# EasyEDA Pro project ConeZ-v0_1.eprj, board PCB1
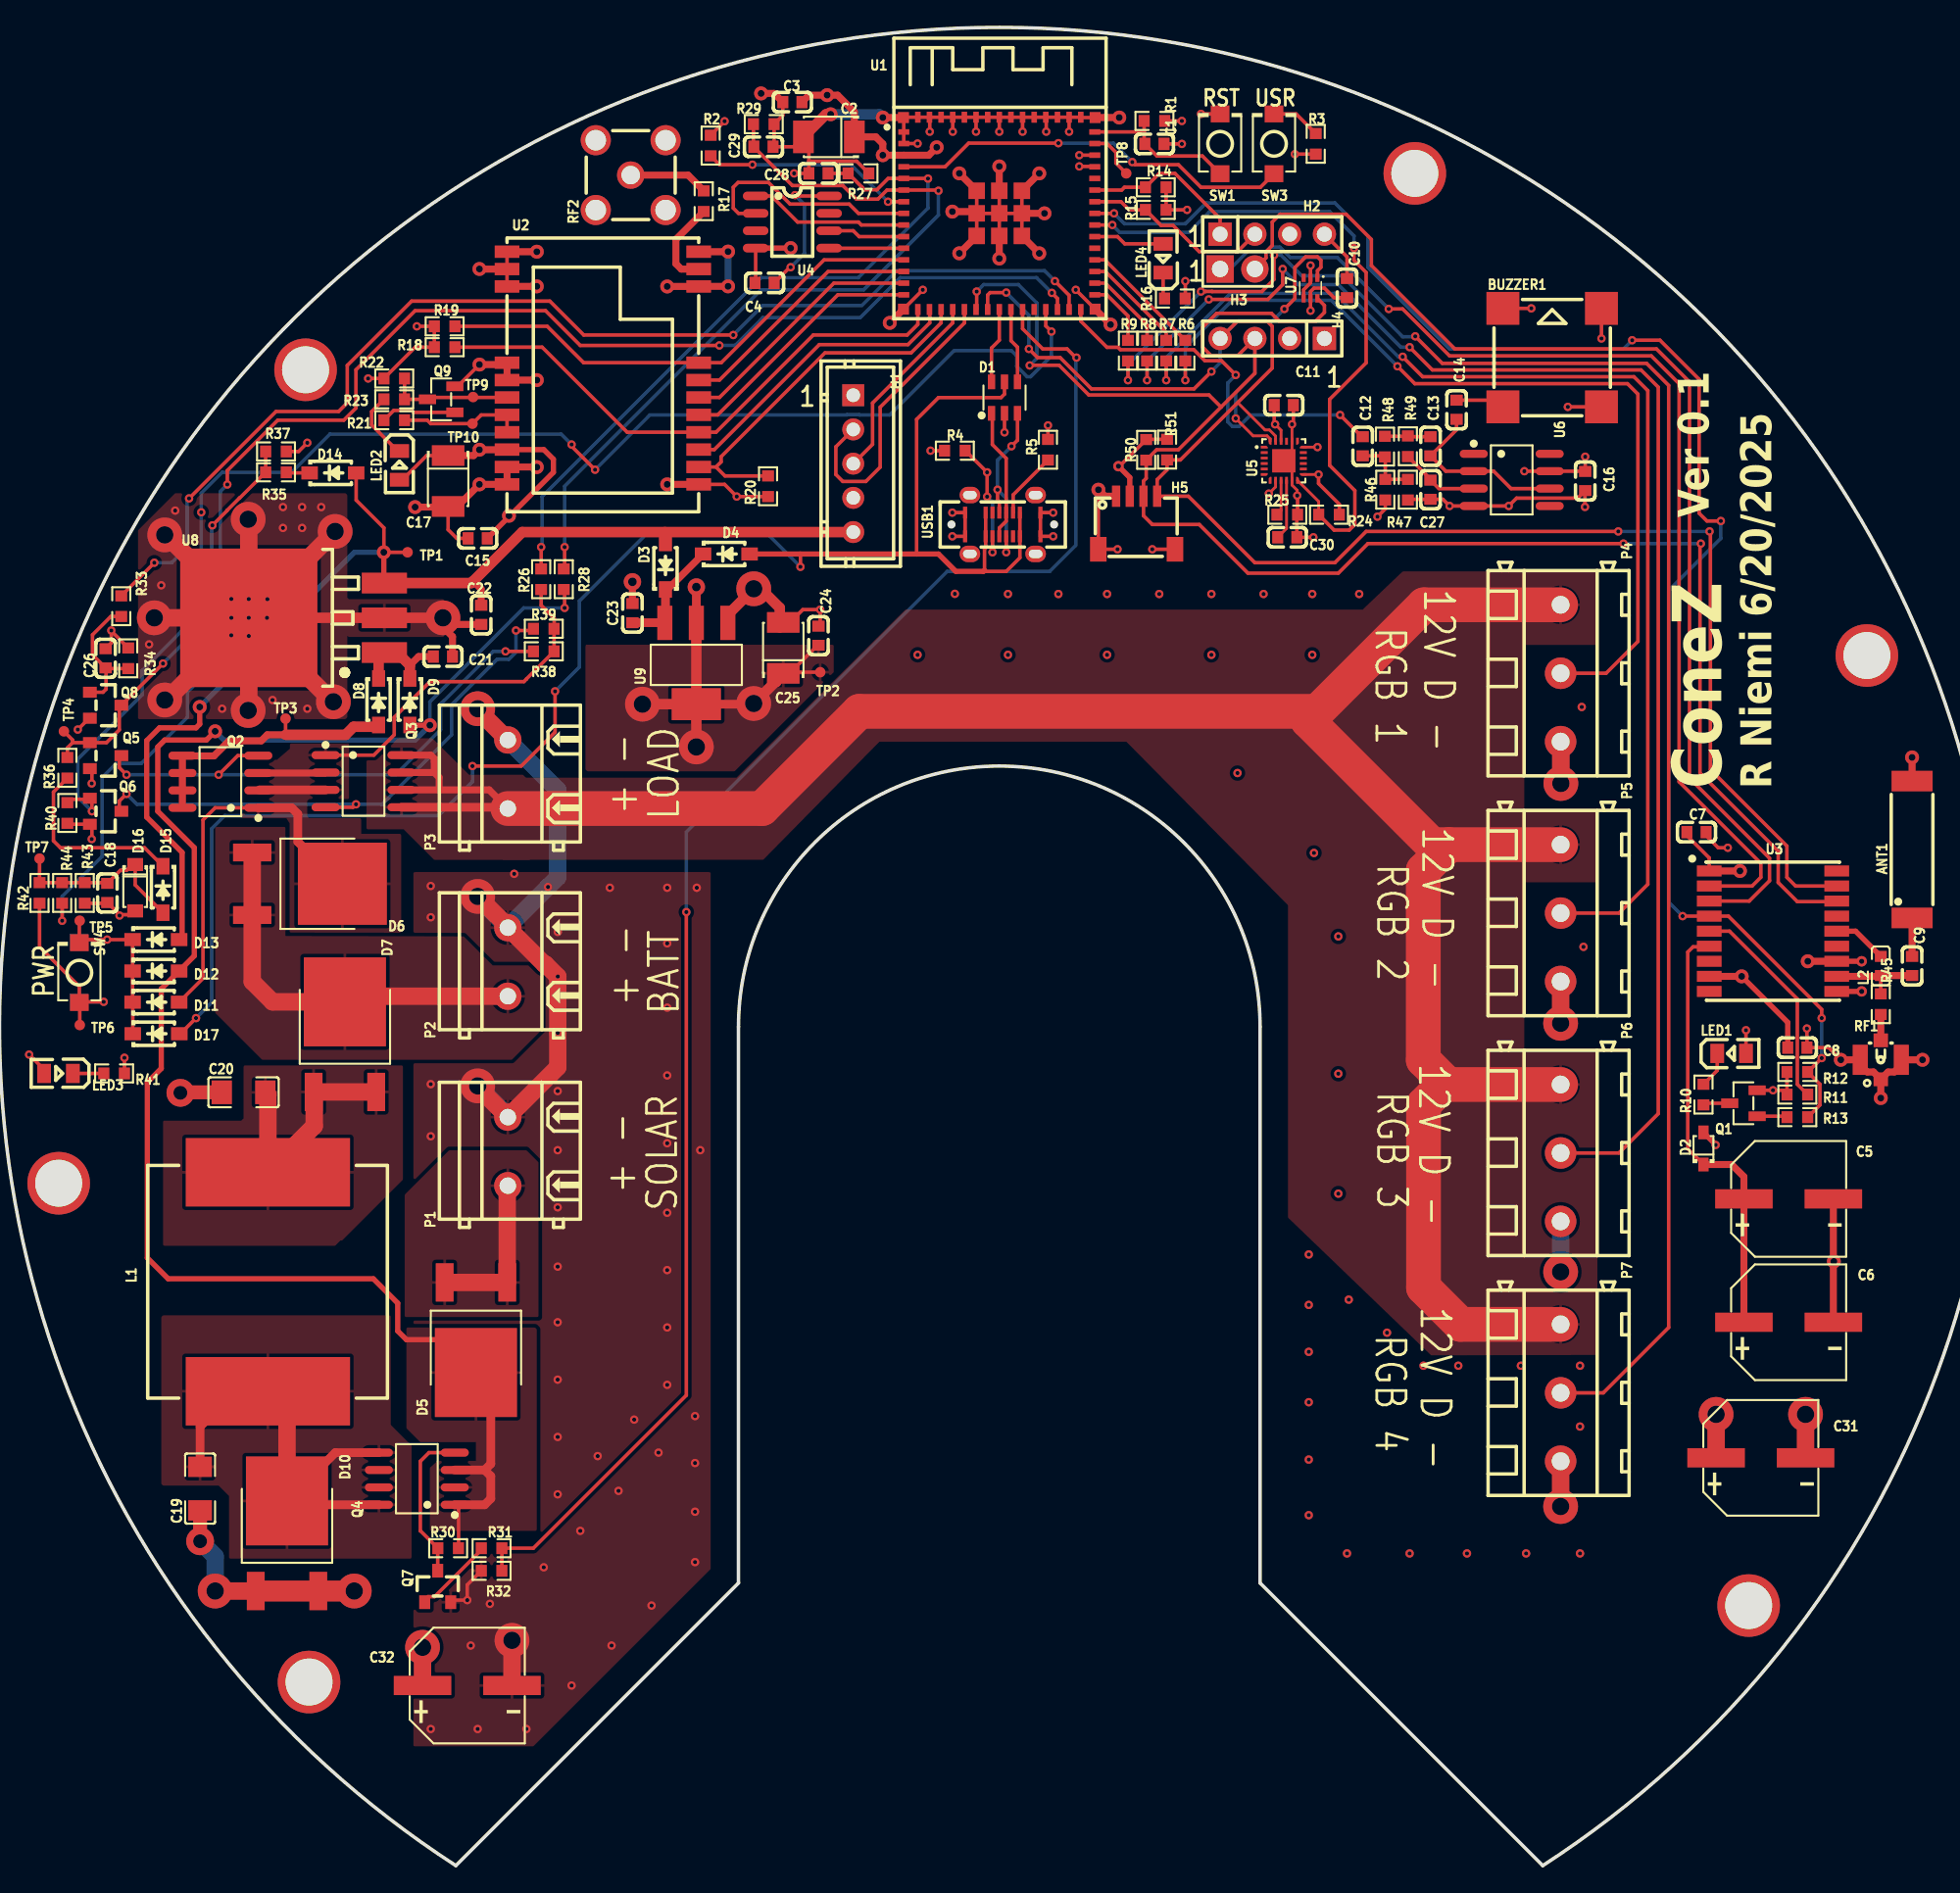
[diagram p1: board, top side]
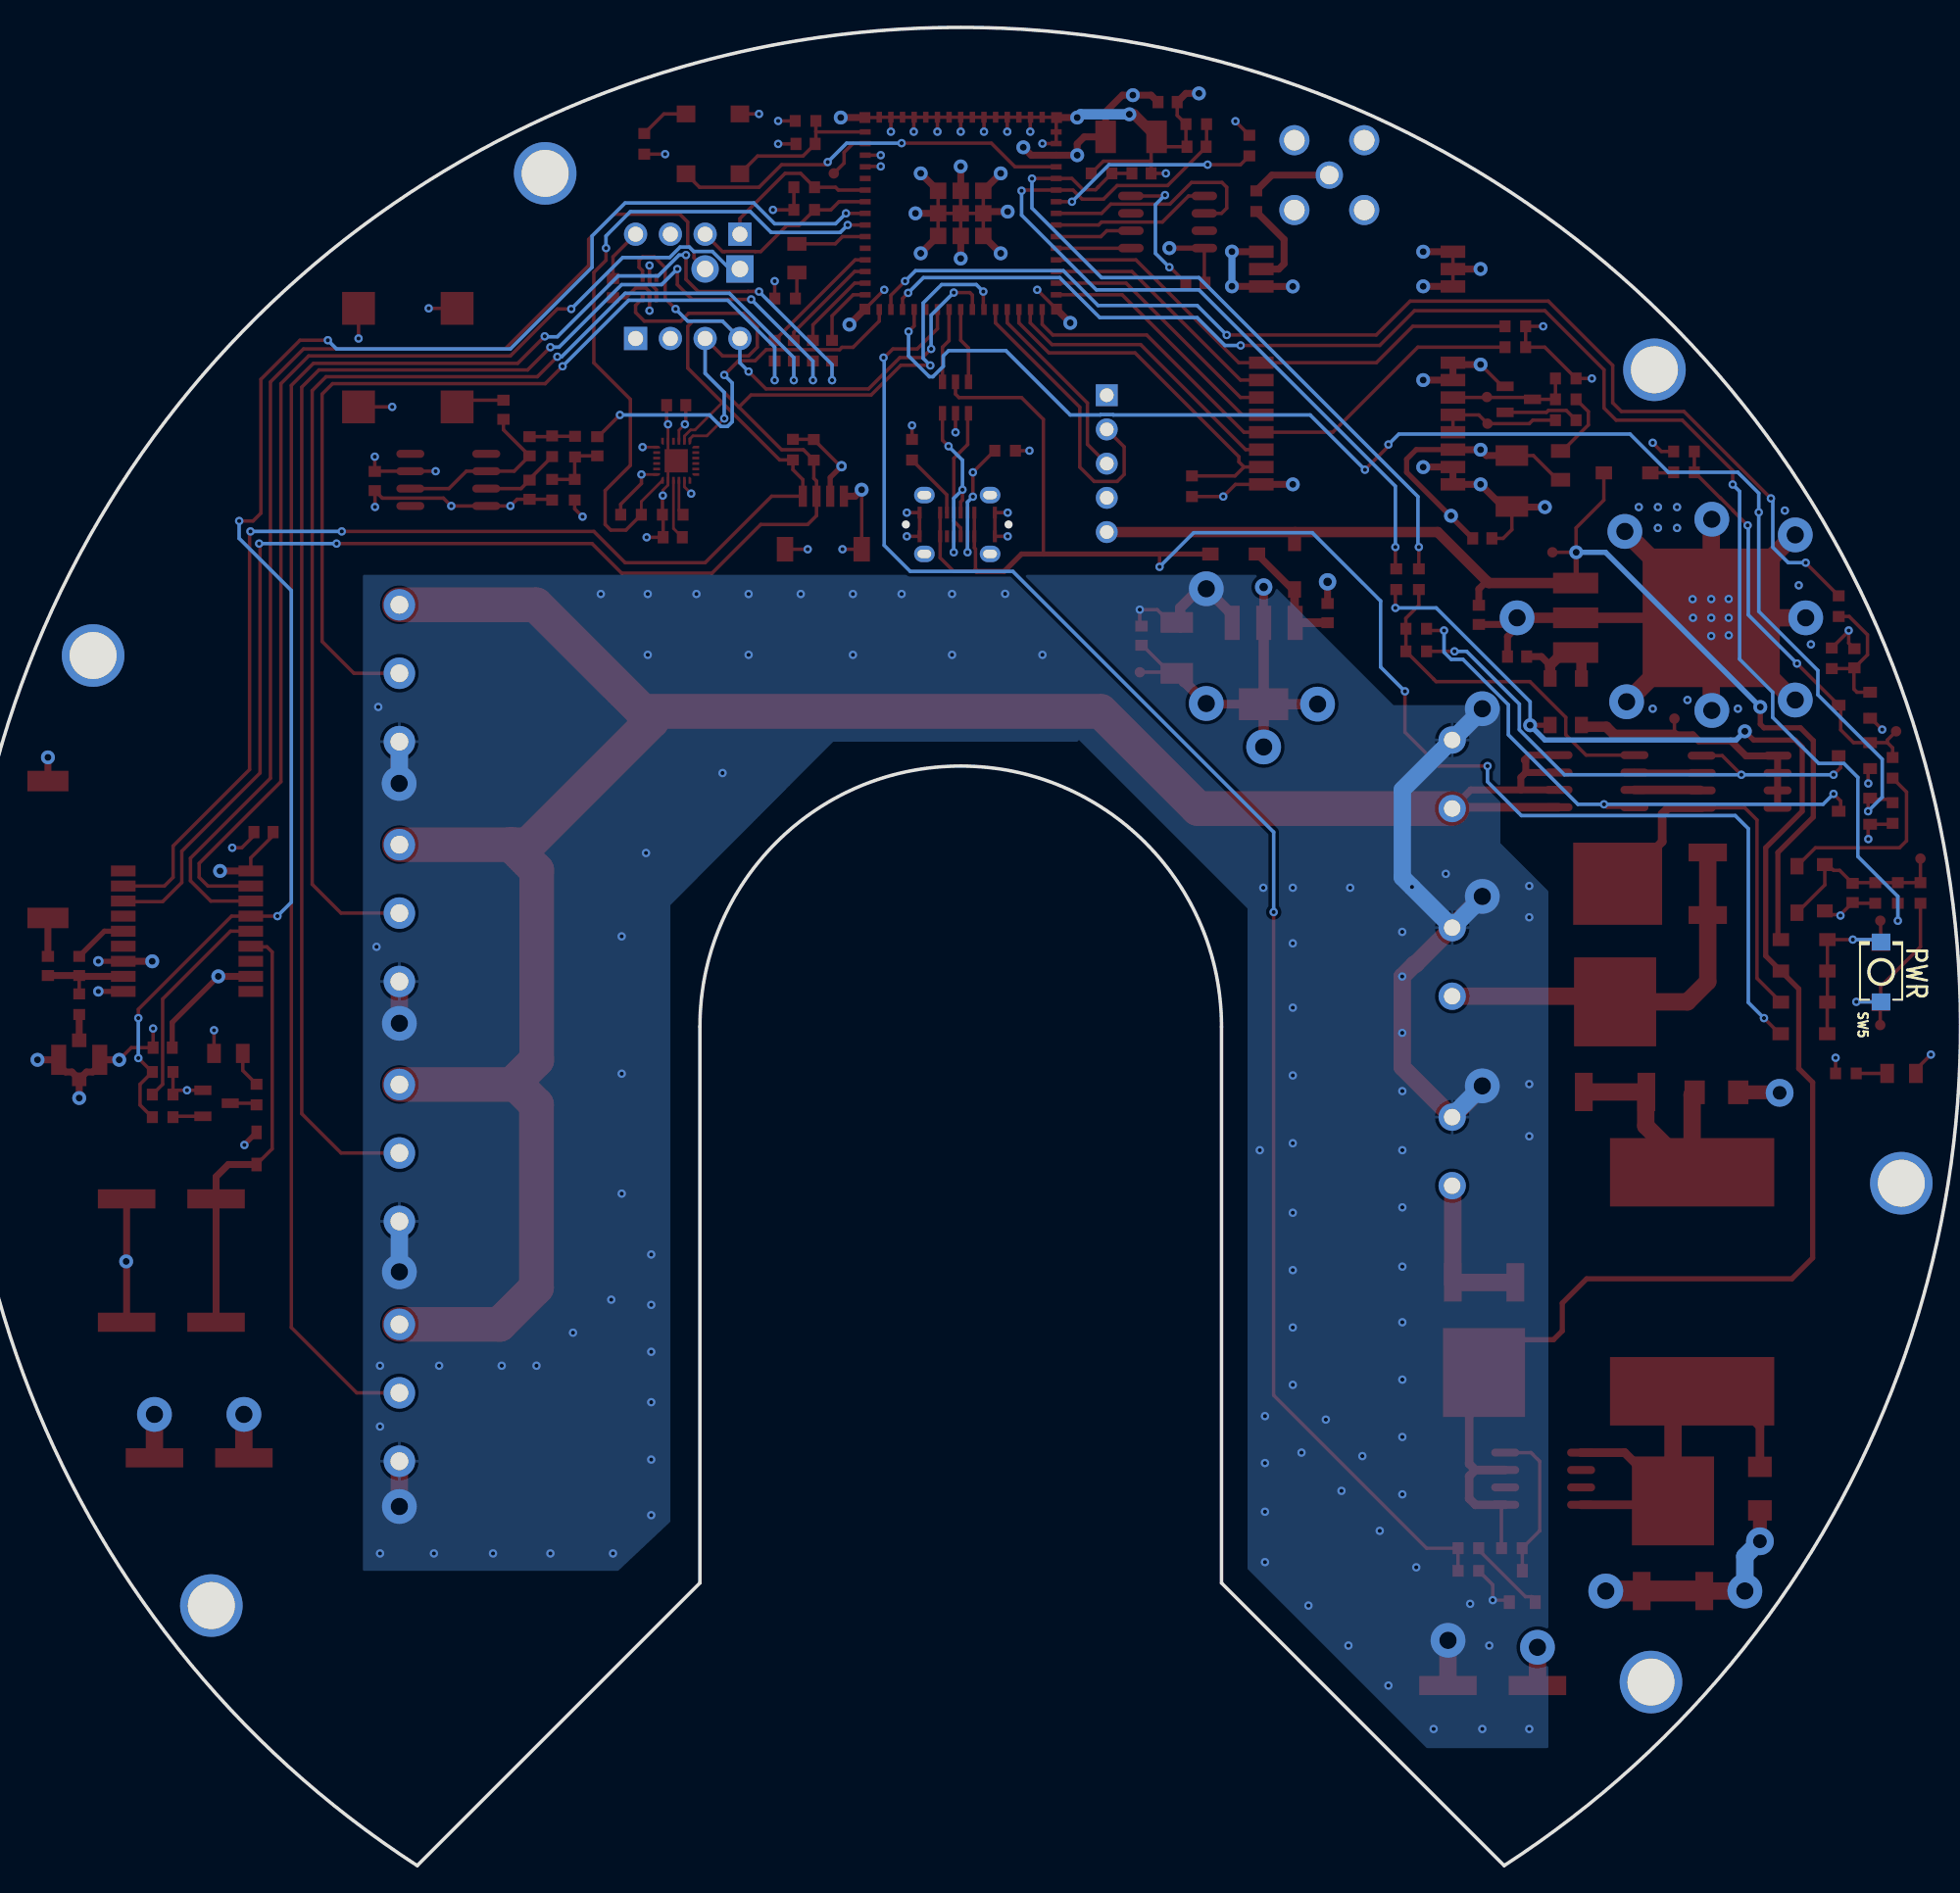
[diagram p2: board, bottom side, seen from below]

Outline 146.05 x 134.32 mm; copper layers: Top Layer, Inner1, Inner2, Bottom Layer. Coordinates in mm from the lower left corner of the outline.
Outline path: 33.33,0 arc(73.03,134.32) 112.72,0 92.08,20.65 92.08,61.29 arc(73.03,80.34) 53.98,61.29 53.98,20.65 33.33,0
Stack: Top Layer 0.035mm Outer layer thickness 1oz / Dielectric1 0.2104mm 7628 RC49% 8.6mil / Inner1 0.0152mm Inner layer thickness / Dielectric2 1.065mm 1.1mm H/HOZ Copper / Inner2 0.0152mm Inner layer thickness / Dielectric3 0.2104mm 7628 RC49% 8.6mil / Bottom Layer 0.035mm Outer layer thickness 1oz

## Design rules (mm)
template: JLCPCB Capability(Multiple Layers Board)
spacing copperThickness1oz (default): track to track 0.102, other pairs 0.152 to 0.3
spacing copperThickness2oz: track to track 0.203, other pairs 0.152 to 0.3
spacing copperThicknessInner0.5oz: track to track 0.089, other pairs 0.152 to 0.3
track width copperThickness1oz (default): min 0.102, default 0.254, max 2.54
track width copperThickness2oz: min 0.203, default 0.254, max 2.54
track width copperThickness0.5oz: min 0.089, default 0.254, max 2.54
differential pair differentialPair (default): width min 0.127, default 0.254, max 2.54; gap min 0.152, default 0.152
via viaSize (default): diameter min 0.3, default 0.61, max 10; hole min 0.2, default 0.305, max 6.3

## Placement (name value [footprint] x y rotation side)
ANT1  GPS1003  [ANT-SMD_L10.0-W3.0]  139.7 74.25 90 top
BUZZER1  2.7kHz  [BUZ-SMD_4P-L8.5-W8.5-P8.50-BR]  113.41 110.19 0 top
C1  1uF  [C0603]  84.36 125.8 180 top
C2  100uF  [CASE-B_3528]  60.58 126.32 180 top
C3  100nF  [C0603]  57.91 128.86 0 top
C4  100nF  [C0603]  55.88 115.65 0 top
C5  1000uF  [CAP-SMD_BD8.0-L8.3-W8.3-FD]  130.69 48.72 0 top
C6  1000uF  [CAP-SMD_BD8.0-L8.3-W8.3-FD]  130.69 39.7 0 top
C7  100nF  [C0603]  123.95 75.52 0 top
C8  10uF  [C0603]  131.32 59.77 180 top
C9  47pF  [C0603]  139.7 65.74 270 top
C10  100nF  [C0603]  98.43 115.27 270 top
C11  100nF  [C0603]  93.81 106.71 180 top
C12  1uF  [C0603]  99.57 103.71 270 top
C13  2.2nF  [C0603]  104.52 103.71 270 top
C14  1uF  [C0603]  106.43 106.38 90 top
C15  100nF  [C0603]  34.93 96.98 0 top
C16  10uF  [C0603]  115.83 101.17 90 top
C17  100uF  [CASE-B_3528]  32.77 101.17 270 top
C18  1uF  [C0603]  7.88 71.07 90 top
C19  22uF  [C1206]  14.65 27.55 90 top
C20  22uF  [C1206]  17.82 56.5 0 top
C21  10uF  [C0603]  32.39 88.34 180 top
C22  10uF  [C0603]  35.18 91.39 90 top
C23  10uF  [C0603]  46.23 91.52 270 top
C24  10uF  [C0603]  59.82 89.87 270 top
C25  100uF  [CASE-B_3528]  57.25 88.98 90 top
C26  1uF  [C0603]  7.75 88.22 270 top
C27  1nF  [C0603]  104.52 100.54 90 top
C28  100nF  [C0603]  59.82 123.65 0 top
C29  100nF  [C0603]  55.8 125.6 180 top
C30  100nF  [C0603]  94.06 97.06 180 top
C31  1000uF  [CAP-SMD_BD8.0-L8.3-W8.3-FD]  128.65 29.8 0 top
C32  1000uF  [CAP-SMD_BD8.0-L8.3-W8.3-FD]  34.17 13.16 0 top
D1  USBLC6-2SC6  [SOT-23-6_L2.9-W1.6-P0.95-LS2.8-BL]  73.41 107.27 0 top
D2  1N5819WS  [SOD-323_L1.8-W1.3-LS2.5-RD]  124.46 52.4 90 top
D3  B5819W SL  [SOD-123_L2.7-W1.6-LS3.7-RD-1]  48.64 94.95 90 top
D4  B5819W SL  [SOD-123_L2.7-W1.6-LS3.7-RD-1]  53.09 95.84 0 top
D5  MOT2045D  [TO-252-2_L6.6-W6.1-P4.57-LS10.0-BR-CW]  34.8 39.32 90 top
D6  MOT2045D  [TO-252-2_L6.6-W6.1-P4.57-LS10.0-BR-CW]  21.75 71.74 180 top
D7  MOT2045D  [TO-252-2_L6.6-W6.1-P4.57-LS10.0-BR-CW]  25.23 59.82 270 top
D8  B5819W SL  [SOD-123_L2.7-W1.6-LS3.7-RD-1]  27.69 85.04 270 top
D9  B5819W SL  [SOD-123_L2.7-W1.6-LS3.7-RD-1]  29.97 85.04 270 top
D10  MOT2045D  [TO-252-2_L6.6-W6.1-P4.57-LS10.0-BR-CW]  21 23.36 270 top
D11  B5819W SL  [SOD-123_L2.7-W1.6-LS3.7-RD-1]  11.42 63.09 0 top
D12  B5819W SL  [SOD-123_L2.7-W1.6-LS3.7-RD-1]  11.42 65.37 0 top
D13  B5819W SL  [SOD-123_L2.7-W1.6-LS3.7-RD-1]  11.42 67.66 0 top
D14  B5819W SL  [SOD-123_L2.7-W1.6-LS3.7-RD-1]  24.35 101.76 0 top
D15  B5819W SL  [SOD-123_L2.7-W1.6-LS3.7-RD-1]  11.94 71.33 270 top
D16  MMSZ5231B-7-F  [SOD-123_L2.8-W1.8-LS3.7-RD]  9.91 71.45 270 top
D17  B5819W SL  [SOD-123_L2.7-W1.6-LS3.7-RD-1]  11.43 60.78 0 top
H1  XH-5A  [CONN-TH_5P-P2.50_XH-5A_C2318]  62.36 102.44 270 top
H2  KH-2.54PH180-1X4P-L11.5  [HDR-TH_4P-P2.54-V-M]  92.97 119.2 0 top
H3  KH-2.54PH180-1X2P-L11.5  [HDR-TH_2P-P2.54-V-M]  90.43 116.66 0 top
H4  KH-2.54PH180-1X4P-L11.5  [HDR-TH_4P-P2.54-V-M]  92.97 111.58 180 top
H5  SM04B-SRSS-TB(LF)(SN)  [CONN-SMD_4P-P1.00_SM04B-SRSS-TB-LF-SN]  83.06 98.12 0 top
L1  22uH  [IND-SMD_L17.5-W17.0_YXMAC1770]  19.6 42.66 90 top
L2  47nH  [L0603]  137.42 65.74 90 top
LED1  KT-0805Y  [LED0805-R-RD]  126.52 59.35 0 top
LED2  KT-0805Y  [LED0805-R-RD]  29.21 102.31 270 top
LED3  KT-0805Y  [LED0805-R-RD]  4.31 57.88 180 top
LED4  KT-0805Y  [LED0805-R-RD]  84.99 117.45 90 top
NOREF  -  [Pad_e3832]  4.32 49.86 0 top
NOREF#2  -  [Pad_e3827]  22.35 109.3 0 top
NOREF#3  -  [Pad_e3830]  136.4 88.42 0 top
NOREF#4  -  [Pad_e3831]  127.76 19 0 top
NOREF#5  -  [Pad_e3829]  103.38 123.65 0 top
NOREF#6  -  [Pad_e3833]  22.61 13.41 0 top
P1  WJ128V-5.0-2P  [CONN-TH_2P-P5.00_WJ128V-5.0-2P]  37.13 52.19 90 top
P2  WJ128V-5.0-2P  [CONN-TH_2P-P5.00_WJ128V-5.0-2P]  37.13 66.03 90 top
P3  WJ128V-5.0-2P  [CONN-TH_2P-P5.00_WJ128V-5.0-2P]  37.13 79.75 90 top
P4  WJ128V-5.0-3P  [CONN-TH_3P-P5.00_WJ128V-5.0-3P]  114.03 87.13 270 top
P5  WJ128V-5.0-3P  [CONN-TH_3P-P5.00_WJ128V-5.0-3P]  114.03 69.6 270 top
P6  WJ128V-5.0-3P  [CONN-TH_3P-P5.00_WJ128V-5.0-3P]  114.03 52.07 270 top
P7  WJ128V-5.0-3P  [CONN-TH_3P-P5.00_WJ128V-5.0-3P]  114.03 34.55 270 top
Q1  MMBT2222A 1P  [SOT-23-3_L2.9-W1.3-P1.90-LS2.4-BR]  127.38 55.7 0 top
Q2  IRF9310TRPBF  [SOIC-8_L4.9-W3.9-P1.27-LS6.0-BL]  16.13 79.2 90 top
Q3  IRF9310TRPBF  [SOIC-8_L4.9-W3.9-P1.27-LS6.0-BL]  26.59 79.24 270 top
Q4  IRF9310TRPBF  [SOIC-8_L4.9-W3.9-P1.27-LS6.0-BL]  30.48 28.27 90 top
Q5  AO3400  [SOT-23_L2.9-W1.3-P1.90-LS2.4-BR]  7.75 81.1 180 top
Q6  AO3400  [SOT-23_L2.9-W1.3-P1.90-LS2.4-BR]  7.75 77.04 180 top
Q7  AO3400  [SOT-23_L2.9-W1.3-P1.90-LS2.4-BR]  32.01 20.4 270 top
Q8  AO3400  [SOT-23_L2.9-W1.3-P1.90-LS2.4-BR]  7.75 84.79 180 top
Q9  MMBT2222A 1P  [SOT-23-3_L2.9-W1.3-P1.90-LS2.4-BR]  32.26 107.14 0 top
R1  10kΩ  [R0603]  84.36 127.48 0 top
R2  10kΩ  [R0603]  51.95 125.68 90 top
R3  1kΩ  [R0603]  96.14 125.81 90 top
R4  5.1kΩ  [R0603]  69.78 103.39 0 top
R5  5.1kΩ  [R0603]  76.58 103.46 270 top
R6  0Ω  [R0603]  86.62 110.7 270 top
R7  0Ω  [R0603]  85.22 110.7 270 top
R8  0Ω  [R0603]  83.82 110.7 270 top
R9  0Ω  [R0603]  82.43 110.7 270 top
R10  200Ω  [R0603]  124.46 56.34 90 top
R11  10kΩ  [R0603]  131.32 56.34 0 top
R12  10kΩ  [R0603]  131.32 57.99 0 top
R13  1kΩ  [R0603]  131.32 54.69 180 top
R14  10kΩ  [R0603]  84.46 122.63 0 top
R15  10kΩ  [R0603]  84.46 120.98 0 top
R16  200Ω  [R0603]  85.85 114.51 180 top
R17  0Ω  [R0603]  51.44 121.62 270 top
R18  10kΩ  [R0603]  32.51 110.95 180 top
R19  10kΩ  [R0603]  32.51 112.47 180 top
R20  10kΩ  [R0603]  56.14 100.79 90 top
R21  1kΩ  [R0603]  28.83 105.62 0 top
R22  10kΩ  [R0603]  28.83 108.66 180 top
R23  200Ω  [R0603]  28.83 107.14 180 top
R24  10kΩ  [R0603]  97.11 98.71 0 top
R25  10kΩ  [R0603]  94.06 98.71 180 top
R26  220kΩ  [R0603]  39.56 94 270 top
R27  10kΩ  [R0603]  62.74 123.65 180 top
R28  220kΩ  [R0603]  41.21 94 270 top
R29  10kΩ  [R0603]  55.82 127.25 180 top
R30  1kΩ  [R0603]  32.77 23.19 0 top
R31  100Ω  [R0603]  35.94 23.19 180 top
R32  10kΩ  [R0603]  35.94 21.54 0 top
R33  1kΩ  [R0603]  8.89 92.03 90 top
R34  10kΩ  [R0603]  9.4 88.22 270 top
R35  1kΩ  [R0603]  20.2 101.81 0 top
R36  1kΩ  [R0603]  4.96 80.22 270 top
R37  10kΩ  [R0603]  20.2 103.33 180 top
R38  10kΩ  [R0603]  39.75 88.72 0 top
R39  10kΩ  [R0603]  39.75 90.38 0 top
R40  10kΩ  [R0603]  4.96 76.91 90 top
R41  200Ω  [R0603]  8.37 57.88 180 top
R42  1kΩ  [R0603]  2.92 71.07 270 top
R43  100kΩ  [R0603]  6.23 71.07 90 top
R44  10kΩ  [R0603]  4.57 71.07 90 top
R45  0Ω  [R0603]  137.42 62.94 270 top
R46  100kΩ  [R0603]  101.22 100.54 270 top
R47  100kΩ  [R0603]  102.87 100.54 90 top
R48  10kΩ  [R0603]  101.2 103.69 90 top
R49  10kΩ  [R0603]  102.87 103.71 90 top
R50  4.7kΩ  [R0603]  83.76 103.45 270 top
R51  4.7kΩ  [R0603]  85.28 103.47 270 top
RF1  KH-IPEX-K501-29  [ANT-SMD_KH-IPEX-K501-29]  137.42 58.88 0 top
RF2  BWSMA-KE-Z001  [SMA-TH_BWSMA-KE-Z001]  46.1 123.52 90 top
SW1  TS-1088-AR02016  [SW-SMD_L3.9-W3.0-P4.45]  89.16 125.81 90 top
SW3  TS-1088-AR02016  [SW-SMD_L3.9-W3.0-P4.45]  93.09 125.81 90 top
SW4  TS-1088-AR02016  [SW-SMD_L3.9-W3.0-P4.45]  5.83 65.25 90 top
SW5  TS-1088-AR02016  [SW-SMD_L3.9-W3.0-P4.45]  5.8 65.3 90 bottom
TP1  -  [Test-Point-0.5mm]  29.8 95.96 0 top
TP2  -  [Test-Point-0.5mm]  59.95 87.2 0 top
TP3  -  [Test-Point-0.5mm]  20.89 83.81 0 top
TP4  -  [Test-Point-0.5mm]  4.7 82.88 0 top
TP5  -  [Test-Point-0.5mm]  5.86 69.04 180 top
TP6  -  [Test-Point-0.5mm]  5.86 61.42 180 top
TP7  -  [Test-Point-0.5mm]  2.92 73.58 0 top
TP8  -  [Test-Point-0.5mm]  82.3 123.65 0 top
TP9  -  [Test-Point-0.5mm]  34.59 107.31 0 top
TP10  -  [Test-Point-0.5mm]  34.55 105.36 0 top
U1  ESP32-S3-MINI  [BULETM-SMD_ESP32-S3-MINI-1-N8]  73.03 120.73 0 top
U2  E22-400M22S  [WIRELM-SMD_E22-400M22S]  44.07 109.43 180 top
U3  ATGM336H-5NR32  [GPS-SMD_18P-L10.1-W9.7-P1.10-TL]  129.54 68.28 0 top
U4  LY68L6400SLIT  [SOP-8_L4.9-W3.9-P1.27-LS6.0-BL]  57.91 120.09 270 top
U5  MPU-6500  [QFN-24_L3.0-W3.0-P0.40-BL-EP]  93.81 102.65 270 top
U6  TL071HIDR  [SOIC-8_L4.9-W3.9-P1.27-LS6.0-BL]  110.46 101.25 270 top
U7  TMP102AIDRLR  [SOT-563_L1.6-W1.2-P0.50-LS1.6-BR]  95.76 115.27 90 top
U8  LM7805S/TR  [TO-263-3_L8.6-W10.2-P2.54-LS14.4-BR]  23.16 91.18 0 top
U9  AMS1117-3.3  [SOT-223-3_L6.5-W3.4-P2.30-LS7.0-BR]  50.9 87.84 90 top
USB1  TYPEC-303-ACP16  [USB-C-SMD_TYPEC-303-ACP16]  73.28 98 0 top

## Footprints (pads in the part's own frame, mm; a bottom-side part is the same pattern mirrored in y, then rotated)
ANT-SMD_KH-IPEX-K501-29
  rect 1.05x1 smd: 1(0,-1.425) 4(0,1.425)
  rect 1.1x2.2 smd: 2(-1.5,0) 3(1.5,0)
ANT-SMD_L10.0-W3.0
  rect 1.5x3 smd: 1(-5,0) 2(5,0)
BULETM-SMD_ESP32-S3-MINI-1-N8
  rect 0.8x0.4 smd: 1(-6.975,5.95) 2(-6.975,5.1) 3(-6.975,4.25) 4(-6.975,3.4) 5(-6.975,2.55) 6(-6.975,1.7) 7(-6.975,0.85) 8(-6.975,0) 9(-6.975,-0.85) 10(-6.975,-1.7) 11(-6.975,-2.55) 12(-6.975,-3.4) 13(-6.975,-4.25) 14(-6.975,-5.1) 15(-6.975,-5.95) 31(6.975,-5.95) 32(6.975,-5.1) 33(6.975,-4.25) 34(6.975,-3.4) 35(6.975,-2.55) 36(6.975,-1.7) 37(6.975,-0.85) 38(6.975,0) 39(6.975,0.85) 40(6.975,1.7) 41(6.975,2.55) 42(6.975,3.4) 43(6.975,4.25) 44(6.975,5.1) 45(6.975,5.95)
  rect 0.4x0.8 smd: 16(-5.95,-7.025) 17(-5.1,-7.025) 18(-4.25,-7.025) 19(-3.4,-7.025) 20(-2.55,-7.025) 21(-1.7,-7.025) 22(-0.85,-7.025) 23(0,-7.025) 24(0.85,-7.025) 25(1.7,-7.025) 26(2.55,-7.025) 27(3.4,-7.025) 28(4.25,-7.025) 29(5.1,-7.025) 30(5.95,-7.025) 46(5.95,7.025) 47(5.1,7.025) 48(4.25,7.025) 49(3.4,7.025) 50(2.55,7.025) 51(1.7,7.025) 52(0.85,7.025) 53(0,7.025) 54(-0.85,7.025) 55(-1.7,7.025) 56(-2.55,7.025) 57(-3.4,7.025) 58(-4.25,7.025) 59(-5.1,7.025) 60(-5.95,7.025)
  rect 0.8x0.8 smd: GND(-7,7) GND(-7,-7) GND(7,7) GND(7,-7)
  rect 1.2x1.2 smd: GND(-1.65,1.65) GND(-1.65,0) GND(-1.65,-1.65) GND(0,1.65) GND(0,0) GND(0,-1.65) GND(1.65,1.65) GND(1.65,0) GND(1.65,-1.65)
BUZ-SMD_4P-L8.5-W8.5-P8.50-BR
  rect 2.4x2.4 smd: 1(-3.6,-3.6) 2(3.6,-3.6) 3(3.599,3.599) 4(-3.6,3.6)
C0603
  rect 0.8x0.9 smd: 1(-0.7,0) 2(0.7,0)
C1206
  rect 1.485x1.728 smd: 1(-1.593,0) 2(1.593,0)
CAP-SMD_BD8.0-L8.3-W8.3-FD
  rect 4.2x1.4 smd: 1(-3.267,0) 2(3.267,0)
CASE-B_3528
  rect 1.506x2.376 smd: 1(-1.861,0) 2(1.861,0)
CONN-SMD_4P-P1.00_SM04B-SRSS-TB-LF-SN
  rect 0.6x1.55 smd: 1(-1.5,1.938) 2(-0.5,1.938) 3(0.5,1.938) 4(1.5,1.938)
  rect 1.2x1.8 smd: 5(2.8,-1.938) 6(-2.8,-1.938)
CONN-TH_2P-P5.00_WJ128V-5.0-2P
  round 2 hole 1.2: 1(-2.505,0) 2(2.505,0)
CONN-TH_3P-P5.00_WJ128V-5.0-3P
  round 2.3 hole 1.3: 1(-5,0) 2(0.003,0) 3(5,0)
CONN-TH_5P-P2.50_XH-5A_C2318
  rect 1.6x1.6 hole 1: 1(-5,0)
  round 1.6 hole 1: 2(-2.5,0) 3(0,0) 4(2.5,0) 5(5,0)
GPS-SMD_18P-L10.1-W9.7-P1.10-TL
  rect 1.8x0.8 smd: 1(-4.657,4.4) 2(-4.657,3.3) 3(-4.657,2.2) 4(-4.657,1.1) 5(-4.657,0) 6(-4.657,-1.1) 7(-4.657,-2.2) 8(-4.657,-3.3) 9(-4.657,-4.4) 10(4.657,-4.4) 11(4.657,-3.3) 12(4.657,-2.2) 13(4.657,-1.1) 14(4.657,0) 15(4.657,1.1) 16(4.657,2.2) 17(4.657,3.3) 18(4.657,4.4)
HDR-TH_2P-P2.54-V-M
  rect 2x2 hole 1.2: 1(-1.27,0)
  round 2 hole 1.2: 2(1.27,0)
HDR-TH_4P-P2.54-V-M
  rect 1.7x1.7 hole 1.1: 1(-3.81,0)
  round 1.7 hole 1.1: 2(-1.27,0) 3(1.27,0) 4(3.81,0)
IND-SMD_L17.5-W17.0_YXMAC1770
  rect 5x12 smd: 1(-8,0) 2(8,0)
L0603
  rect 0.8x0.864 smd: 1(-0.7,0) 2(0.7,0)
LED0805-R-RD
  rect 1x1.399 smd: 1(1.05,0) 2(-1.05,0)
Pad_e3827
  round 4.572 hole 3.429: 1(0,0)
Pad_e3829
  round 4.572 hole 3.429: 1(0,0)
Pad_e3830
  round 4.572 hole 3.429: 1(0,0)
Pad_e3831
  round 4.572 hole 3.429: 1(0,0)
Pad_e3832
  round 4.572 hole 3.429: 1(0,0)
Pad_e3833
  round 4.572 hole 3.429: 1(0,0)
QFN-24_L3.0-W3.0-P0.40-BL-EP
  custom 0.2x0.506 smd: 1(-1,-1.427) 6(1,-1.427) 13(1,1.427) 18(-1,1.427)
  rect 0.2x0.505 smd: 2(-0.6,-1.427) 3(-0.2,-1.427) 4(0.2,-1.427) 5(0.6,-1.427) 14(0.6,1.427) 15(0.2,1.427) 16(-0.2,1.427) 17(-0.6,1.427)
  custom 0.506x0.2 smd: 7(1.427,-1) 12(1.427,1) 19(-1.427,1) 24(-1.427,-1)
  rect 0.505x0.2 smd: 8(1.427,-0.6) 9(1.427,-0.2) 10(1.427,0.2) 11(1.427,0.6) 20(-1.427,0.6) 21(-1.427,0.2) 22(-1.427,-0.2) 23(-1.427,-0.6)
  rect 1.7x1.7 smd: 25(0,0)
R0603
  rect 0.806x0.864 smd: 1(-0.753,0) 2(0.753,0)
SMA-TH_BWSMA-KE-Z001
  round 2.2 hole 1.5: 1(-2.55,-2.55) 2(-2.55,2.55) 3(2.55,2.55) 4(2.55,-2.55)
  round 2 hole 1.35: 5(0,0)
SOD-123_L2.7-W1.6-LS3.7-RD-1
  rect 1.2x0.95 smd: 1(-1.7,0) 2(1.7,0)
SOD-123_L2.8-W1.8-LS3.7-RD
  rect 0.95x1.15 smd: 1(-1.692,0) 2(1.692,0)
SOD-323_L1.8-W1.3-LS2.5-RD
  rect 1x0.75 smd: 1(-1.173,0) 2(1.173,0)
SOIC-8_L4.9-W3.9-P1.27-LS6.0-BL
  oval 0.588x2.045 smd: 1(-1.905,-2.772) 2(-0.635,-2.772) 3(0.635,-2.772) 4(1.905,-2.772) 5(1.905,2.772) 6(0.635,2.772) 7(-0.635,2.772) 8(-1.905,2.772)
SOP-8_L4.9-W3.9-P1.27-LS6.0-BL
  oval 0.63x1.865 smd: 1(-1.905,-2.683) 2(-0.635,-2.683) 3(0.635,-2.683) 4(1.905,-2.683) 5(1.905,2.683) 6(0.635,2.683) 7(-0.635,2.683) 8(-1.905,2.683)
SOT-23-3_L2.9-W1.3-P1.90-LS2.4-BR
  rect 1.25x0.7 smd: 1(1,-0.95) 2(1,0.95) 3(-1,0)
SOT-23-6_L2.9-W1.6-P0.95-LS2.8-BL
  rect 0.532x1.072 smd: 1(-0.95,-1.149) 2(0,-1.149) 3(0.95,-1.149) 4(0.95,1.149) 5(0,1.149) 6(-0.95,1.149)
SOT-23_L2.9-W1.3-P1.90-LS2.4-BR
  rect 1x0.8 smd: 1(1.15,-0.95) 2(1.15,0.95) 3(-1.15,0)
SOT-223-3_L6.5-W3.4-P2.30-LS7.0-BR
  rect 2.5x1.1 smd: 1(2.97,-2.3) 2(2.97,0) 3(2.97,2.3)
  rect 2.34x3.6 smd: 4(-2.97,0)
SOT-563_L1.6-W1.2-P0.50-LS1.6-BR
  rect 0.6x0.3 smd: 1(0.75,-0.5) 2(0.75,0) 3(0.75,0.5) 4(-0.75,0.5) 5(-0.75,0) 6(-0.75,-0.5)
SW-SMD_L3.9-W3.0-P4.45
  rect 1.23x1.36 smd: 1(-2.185,0) 2(2.185,0)
Test-Point-0.5mm
  round 0.762 smd: 1(0,0)
TO-252-2_L6.6-W6.1-P4.57-LS10.0-BR-CW
  rect 2.8x1.3 smd: 1(3.292,-2.285) 3(3.292,2.285)
  rect 6.5x6 smd: 2(-3.292,0)
TO-263-3_L8.6-W10.2-P2.54-LS14.4-BR
  rect 3.3x1.511 smd: 1(4.952,-2.54) 2(4.952,0) 3(4.952,2.54)
  rect 10.02x10.122 smd: 4(-4.952,0)
USB-C-SMD_TYPEC-303-ACP16
  oval 1.5x1.2 hole 1x0.61: 1(-2.4,2.15) 2(-2.4,-2.15) 3(2.4,2.15) 4(2.4,-2.15)
  rect 0.3x0.87 smd: A1(-2.75,0.865) A4(-1.25,0.865) A5(-0.75,0.865) A6(-0.25,0.865) A7(0.25,0.865) A8(0.75,0.865) A9(1.25,0.865) A12(2.75,0.865) B1(2.75,-0.865) B4(1.25,-0.865) B5(0.75,-0.865) B6(0.25,-0.865) B7(-0.25,-0.865) B8(-0.75,-0.865) B9(-1.25,-0.865) B12(-2.75,-0.865)
WIRELM-SMD_E22-400M22S
  rect 1.8x0.9 smd: 1(7,-8.5) 2(7,-7.23) 3(7,-5.96) 4(7,-0.39) 5(7,0.88) 6(7,2.15) 7(7,3.42) 8(7,4.69) 9(7,5.96) 10(7,7.23) 11(7,8.5) 12(-7,8.5) 13(-7,7.23) 14(-7,5.96) 15(-7,4.69) 16(-7,3.42) 17(-7,2.15) 18(-7,0.88) 19(-7,-0.39) 20(-7,-5.96) 21(-7,-7.23) 22(-7,-8.5)

## Nets
As in the schematic, except:
GND: ANT1.2 BUZZER1.2 BUZZER1.3 BUZZER1.4 C1.1 C2.2 C3.1 C4.1 C5.2 C6.2 C7.1 C8.1 C10.1 C11.1 C15.1 C16.1 C17.2 C18.1 C19.1 C20.1 C21.1 C22.1 C23.1 C24.1 C25.2 C26.1 C27.1 C28.1 C29.1 C30.1 C31.2 C32.2 D1.2 D10.1 D10.3 D16.2 H1.1 H2.4 H4.1 H5.1 H5.5 H5.6 NOREF.1 NOREF#2.1 NOREF#3.1 NOREF#4.1 NOREF#5.1 NOREF#6.1 P1.2 P2.2 P3.2 P4.3 P5.3 P6.3 P7.3 Q1.2 Q5.2 Q6.2 Q7.2 Q8.2 Q9.2 R3.1 R4.1 R5.1 R11.1 R12.1 R16.1 R20.1 R25.1 R27.1 R29.1 R32.1 R34.1 R37.1 R40.1 R41.1 R43.1 R47.1 RF1.1 RF1.2 RF1.3 RF2.1 RF2.2 RF2.3 RF2.4 SW1.2 U1.1 U1.2 U1.42 U1.43 U1.46 U1.47 U1.48 U1.49 U1.50 U1.51 U1.52 U1.53 U1.54 U1.55 U1.56 U1.57 U1.58 U1.59 U1.60 U1.GND U2.1 U2.2 U2.3 U2.4 U2.5 U2.10 U2.11 U2.12 U2.20 U2.22 U3.1 U3.10 U3.12 U4.4 U5.11 U5.18 U5.20 U5.25 U6.4 U7.2 U7.4 U8.2 U8.4 U9.1 USB1.1 USB1.2 USB1.3 USB1.4 USB1.A1 USB1.A12 USB1.B1 USB1.B12

Pads without a net: U1 26 35 41; U3 7 9 13 15 18; U4 3 7; U5 1 2 3 4 5 6 7 14 15 16 17 19 21; U6 1 5 8; U7 3; USB1 A5 B5

## Via types
v1: diameter 0.61, hole 0.305, Top Layer to Bottom Layer, 250 vias
v2: diameter 2.54, hole 1.27, Top Layer to Bottom Layer, 25 vias
v3: diameter 1.016, hole 0.508, Top Layer to Bottom Layer, 45 vias
v4: diameter 1.27, hole 0.635, Top Layer to Bottom Layer, 2 vias
v5: diameter 2.032, hole 1.016, Top Layer to Bottom Layer, 2 vias
v6: diameter 0.762, hole 0.381, Top Layer to Bottom Layer, 3 vias

## Routing (per net, layer and track width the routed paths; a pad name or vN(x,y) marks a point on that pad's centre or on a via; arc(x,y) is an arc through that point)
3V3: length 134.7
  Top Layer w0.203: U5.8 93.21,100.74 v1(92.72,100.25) ; U5.13 v1(96.35,101.65) ; U5.22 93.61,104.88 v1(93.17,105.32)
  Top Layer w0.254: C17.1 31.2,103.03 29.56,101.39 28.96,101.39 ; v1(115.83,102.95) C16.2 115.81,101.89 U6.7 v1(111.38,101.89) ; v1(126.24,74.37) 125.54,74.37 124.65,75.26 ; v1(58.1,122.06) 58.17,122 U4.8 ; v1(52.96,127.46) 52.96,127.45 R2.2 ; 58.11,87.2 58.11,87.52 59.63,89.04 59.95,89.04 ; 58.11,87.2 TP2.1 ; 58.11,87.2 58.02,87.12 C25.1 ; v1(57.79,116.79) 57.73,116.79 56.58,115.65 ; C10.2 97.48,114.57 96.78,115.27 96.01,115.27 95.76,115.01 U7.5 v1(95.76,113.62) ; v1(100.65,98.57) 101.22,99.14 R46.2 ; v1(86.74,120.98) R15.2 R14.2 ; R51.1 83.78,104.22 R50.1 81.81,102.25 v6(81.73,102.25) ; v1(96.35,101.65) 96.35,100.99 97.86,99.47 R24.2 ; v1(30.48,112.47) R19.2 R18.2 30.36,110.95 R22.2 v1(26.93,108.66) ; v1(93.17,105.32) 93.11,105.38 93.11,106.59 ; v1(2.16,59.26) 3.26,58.17 LED3.1 ; R1.2 v1(86.36,127.48) ; LED1.1 v1(127.57,61.04)
  Top Layer w0.381: 130.62,59.77 130.62,61.61 v3(127.26,64.98) ; D2.2 125.35,52.69 v1(125.35,52.66) ; H5.2 82.56,101.42 v6(81.73,102.25) ; C15.2 37.21,98.57 v3(37.21,98.63) 37.28,98.63 40.46,101.81 40.46,102.76 39.75,103.47 37.07,103.47
  Top Layer w0.508: 37.07,103.47 37.06,103.46 v3(35.05,103.46) 34.63,103.03 C17.1 ; C3.2 59.12,129.36 v3(60.45,129.36) 61.22,129.36 62.44,128.14 C2.1 64.01,126.32 64.52,125.81 v3(64.52,124.98) U1.3 67.88,124.98 v3(68.46,125.55) ; 124.88,64.98 v3(127.26,64.98)
  Top Layer w0.635: U9.4 55.04,84.87 v2(55.09,84.91) ; U9.2 v4(50.9,93.42)
  Top Layer w0.762: v2(46.96,84.87) U9.4 v2(50.9,81.74) ; v2(55.09,84.91) 56.66,86.48 56.74,86.48 ; U9.2 50.9,85.17
  Top Layer w1.27: C31.1 v2(125.39,32.97) ; C32.1 v2(30.9,15.95)
  Bottom Layer w0.254: v1(57.79,116.79) 58.8,117.81 58.8,121.36 v1(58.1,122.06)
5V: length 88.3
  Top Layer w0.254: D3.2 48.64,97.4 48.6,97.44 ; v3(28.07,95.96) 28.08,95.97 28.08,97.75 26.05,99.77 D14.2 ; 29.42,95.96 28.07,95.96
  Top Layer w0.381: v3(28.07,95.96) 28.07,93.76 U8.3 ; D13.2 13.34,67.88 13.34,74.03 10.75,76.61 10.75,82.2 11.69,83.14 14.35,83.14 14.62,83.41 v3(14.62,84.66)
  Top Layer w0.508: 34.6,93.86 35.18,93.28 C22.2
  Top Layer w0.762: U8.3 34.46,93.72 38.18,97.44 H1.5
  Bottom Layer w0.381: v3(14.62,84.66) 25.93,95.96 v3(28.07,95.96)
12V_BLAH: length 63.3
  Top Layer w0.254: Q2.1 15.75,77.29 14.86,76.41 14.86,64.83 D11.2 ; R26.2 39.56,92.09 40.52,91.14 40.52,90.38 R39.2 R38.2 38.48,86.7 38.48,86.69 38.3,86.51 31.45,86.51 28.83,83.9 28.83,82.63 27.35,81.14 Q3.1
  Top Layer w0.508: Q2.3 23.78,79.83 Q3.2
  Top Layer w0.635: Q2.1 21.34,77.29 21.79,76.85 21.79,74.81 24.86,71.74 D6.2 ; 18.99,78.6 Q3.3
12V_IN: length 28.9
  Top Layer w1.27: P2.1 25.64,63.52 D7.2 19.94,63.11 18.46,64.59 D6.3 D6.1
12V_LOAD: length 183.8
  Top Layer w0.508: 32.09,78.6 35.77,78.6 37.04,77.33 ; 32.09,78.6 32.11,78.62 32.11,79.51 31.75,79.87 ; 32.09,78.6 Q3.6 ; 31.75,79.87 Q3.7 ; 31.75,79.87 31.75,80.68 31.86,80.78 31.5,81.14 Q3.8
  Top Layer w0.635: P3.1 37.04,77.33 Q3.5
  Top Layer w2.54: 96.27,84.34 104.05,92.13 P4.1 ; 96.27,84.34 62.8,84.34 55.7,77.24 P3.1 ; 96.27,84.34 95.57,83.65 104.62,74.6 105.88,74.6 ; 105.88,74.6 104,72.72 104,58.87 105.64,57.23 ; 105.88,74.6 P5.1 ; P6.1 105.79,57.07 105.64,57.23 ; 105.64,57.23 104.02,55.6 104.02,42.24 106.71,39.55 P7.1
12V_SW: length 20.1
  Top Layer w0.254: 20.91,82.63 20.89,82.64 TP3.1
  Top Layer w0.508: 20.91,82.63 19.56,82.63 19.12,82.18 16.77,82.18 15.67,81.08 13.36,81.08 Q2.6 Q2.7 13.36,77.42
  Top Layer w0.762: 20.91,82.63 25.28,82.63 25.86,83.21 27.56,83.21 D8.2
GND: length 449.5
  Top Layer w0.203: v1(94.79,100.11) 94.79,100.49 94.41,100.87 94.41,102.05 U5.25 94.41,103.25 v1(94.41,105.32) ; U5.18 v1(96.27,103.65)
  Top Layer w0.254: U1.49 U1.48 U1.47 ; U1.49 76.46,127.72 v1(76.46,126.7) ; U1.49 U1.50 U1.51 ; U1.53 v1(73.03,126.7) ; U1.53 U1.52 U1.51 ; U1.53 U1.54 U1.55 ; R32.1 34.17,20.52 v1(34.17,19.4) 32.96,19.4 ; U1.57 U1.58 U1.59 ; U1.57 U1.56 U1.55 ; U1.57 v1(69.63,126.7) ; U1.47 U1.46 79,127.73 U1.GND ; U1.47 v1(78.13,126.7) ; v1(94.79,100.11) 94.82,100.08 R25.1 94.76,98.66 C30.1 v1(95.97,97.06) ; v1(58.04,123.65) C28.1 59.12,124.57 ; R20.1 v1(53.85,100.04) 52.96,100.93 U2.12 ; v1(94.41,105.32) 94.51,105.42 94.51,106.59 ; 123.25,75.26 124.88,73.63 124.88,72.68 ; v1(76.96,97.13) USB1.B1 USB1.A12 v1(76.96,98.86) ; v1(67.06,125.83) U1.2 U1.1 66.05,127.7 U1.GND 66.05,127.75 U1.60 U1.59 ; Q9.2 33.46,108.09 v3(35.05,109.68) ; 8.77,69.48 9.76,69.48 10.04,69.76 ; 8.77,69.48 v1(8.77,69.42) ; 8.77,69.48 C18.1 7.82,70.32 R43.1 ; 59.12,124.57 59.15,124.54 62.6,124.54 R27.1 ; 59.12,124.57 59.12,125.92 C2.2 58,125.6 C29.1 56.58,125.67 R29.1 57.21,127.89 C3.1 ; C10.1 98.43,117.55 H2.4 ; 6.75,80.15 6.75,79.09 v1(6.73,79.07) ; D1.2 v1(73.41,104.73) ; U1.GND v1(78.62,115.14) ; 115.81,100.45 v1(115.81,99.28) ; 115.81,100.45 C16.1 ; 115.81,100.45 115.28,99.92 110.81,99.92 v1(110.24,99.35) U6.4 v1(105.92,99.35) 105.43,99.84 C27.1 102.93,99.84 R47.1 ; v1(6.73,75.01) 6.75,75.02 6.75,76.09 5.02,76.09 R40.1 ; U2.1 U2.2 U2.3 ; U1.55 v1(71.33,126.7) ; v1(78.87,124.16) 79.97,124.16 U1.42 ; U1.59 67.95,127.73 v1(67.95,126.7) ; v1(69.6,98.86) USB1.A1 USB1.B12 v1(69.6,97.13) ; R41.1 v1(9.12,59.03) ; U1.GND U1.GND ; U1.GND U1.GND ; U1.GND U1.GND ; U1.GND U1.GND ; U1.GND U1.GND ; U1.GND U1.GND ; v1(5.72,83.01) 6.75,84.04 6.75,84.09 ; 8.16,90.21 8.16,89.33 C26.1 ; 8.16,90.21 R34.1 ; 8.16,90.21 v1(8.16,90.25) ; U1.51 v1(74.73,126.7) ; R3.1 v1(94.62,125.06) ; BUZZER1.3 v1(117.01,111.58) ; C25.2 57.74,90.84 58.68,91.77 v1(59.95,91.77) 59.95,90.44 ; U1.GND U1.GND ; U1.GND U1.GND ; v3(80.27,100.54) 80.26,100.53 H5.6 v1(81.66,96.19) ; v1(132.02,61.17) C8.1 133.61,59.77 v3(134.5,58.88) ; U1.GND v1(67.44,115.14) ; C15.1 33.4,96.98 32.77,97.61 C17.2 ; U1.43 v1(78.87,124.98) ; R12.1 R11.1 130.25,56.65 v1(129.54,56.65) Q1.2 ; BUZZER1.2 v1(114.56,106.59) ; R16.1 86.62,114.51 v1(86.62,115.78) ; U4.4 55.23,115.7 C4.1 ; H5.5 v1(84.2,96.18) ; R4.1 v1(68,103.39) ; U7.4 95.26,115.15 95.76,115.65 U7.2 v1(95.76,116.92) ; C1.1 v1(86.36,125.8) ; v1(22.48,103.96) 21.85,103.33 R37.1 ; R5.1 v1(76.58,105.23) ; SW1.2 v1(87.76,127.99) ; BUZZER1.4 v1(111.89,113.79)
  Top Layer w0.381: U3.12 v6(136.02,66.08) ; U4.4 v3(57.79,118.19) ; U3.10 v6(136.02,63.88)
  Top Layer w0.508: v3(35.05,109.68) 36.94,109.68 U2.4 U2.5 v3(39.25,108.55) ; ANT1.2 v3(139.7,80.98) ; v3(53.22,115.39) 51.08,115.39 U2.20 v3(48.77,115.39) ; C23.1 v4(46.23,93.8) ; U1.GND v3(81.79,127.73) ; U1.GND 71.25,120.86 v3(69.6,120.86) ; C3.1 56.58,129.49 v3(55.63,129.49) ; RF1.1 137.95,57.99 138.41,57.99 138.92,58.5 RF1.3 v3(140.46,58.88) ; RF1.1 v3(137.42,56.09) ; RF1.1 136.88,57.99 136.42,57.99 135.92,58.5 RF1.2 v3(134.5,58.88) ; U1.GND v3(65.03,112.73) ; C5.2 133.95,44.18 v3(133.99,44.15) 133.95,44.11 C6.2 ; v3(30.36,99.27) 32.72,99.27 C17.2 33.44,99.31 v3(35.05,100.93) U2.11 U2.10 39.24,102.2 v3(39.25,102.19) ; U1.GND v3(76.33,120.73) ; v3(53.22,117.93) 53.21,117.93 U2.22 ; U2.2 35.06,116.66 v3(35.05,116.66) ; 124.88,72.68 v3(127.13,72.68) ; U1.GND v3(70.11,117.81) ; U1.GND v3(73.03,117.43) ; U1.GND v3(70.11,123.65) ; U1.GND v3(75.95,123.65) ; H5.1 80.74,100.06 v3(80.27,100.54) ; U1.GND v3(64.52,127.73) ; C21.1 33.09,89.8 32.39,90.5 v2(32.39,91.18) 32.87,90.69 35.18,90.69 ; v3(39.25,115.39) 37.08,115.39 U2.3 ; U2.12 v3(48.77,100.93) ; U2.1 v3(39.25,117.93) ; U1.GND v3(73.03,124.16) ; U1.GND v3(75.95,117.81) ; U3.12 v3(132.08,66.08) ; U1.GND v3(81.16,112.6)
  Top Layer w0.762: 56.99,90.46 56.99,91.9 55.6,93.3 v2(55.09,93.3) 53.2,91.41 U9.1 ; C2.2 60.37,127.97 v3(60.71,127.97) ; v2(32.39,91.18) U8.2 v1(19.54,91.18) v1(18.21,91.18)
  Top Layer w1.016: C20.1 13.25,56.5 v5(13.21,56.47) ; C19.1 v5(14.65,23.7)
  Top Layer w1.27: v1(18.21,91.18) v1(19.57,92.54) 24.51,97.48 v2(24.51,97.49) ; v1(18.21,91.18) v1(16.93,91.18) v2(11.31,91.18) ; v1(18.21,91.18) v1(18.21,92.55) 18.21,98.33 v2(18.16,98.38) ; v1(18.21,91.18) v1(18.21,89.85) 18.21,84.45 v2(18.16,84.41) ; v1(18.21,91.18) v1(16.93,89.9) 12.2,85.17 v2(12.07,85.17) ; v1(18.21,91.18) 24.34,85.04 v2(24.39,85.04) ; v1(18.21,91.18) 12.15,97.23 v2(12.07,97.23) ; C31.2 v2(131.92,32.97) ; v2(114.03,26.24) P7.3 ; P3.2 34.93,84.45 v2(34.93,84.53) ; v2(114.03,61.55) P5.3 ; P4.3 114.05,82.11 v2(114.05,79.07) ; C32.2 v2(37.43,16.46) ; v2(34.93,70.82) 37.13,68.62 P2.2 39.8,65.86 39.88,65.86 v1(40.78,64.97) v1(40.78,60.85) 40.78,58.34 P1.2 34.93,56.89 v2(34.93,56.97) ; D10.1 v2(15.75,20.07)
  Top Layer w1.524: v2(25.91,20.07) D10.3 D10.1
  Bottom Layer w0.508: v3(53.22,117.93) v3(53.22,115.39)
  Bottom Layer w0.762: v3(64.52,127.73) 64.28,127.97 v3(60.71,127.97)
  Bottom Layer w1.27: P6.3 v2(114.03,43.39) ; P1.2 37.13,54.77 v2(34.93,56.97) ; v2(15.75,20.07) 15.75,22.6 v5(14.65,23.7) ; v2(34.93,84.53) 34.93,84.45 P3.2 40.77,78.61 40.77,72.21 v1(40.06,71.51) 37.13,68.57 P2.2 34.93,70.73 v2(34.93,70.82) ; v2(114.05,79.07) 114.03,79.09 P4.3
  vias: v1(10.92,89.23) v1(11.81,93.55) v1(12.83,99.01) v1(16.26,84.53) v1(16.93,92.55) v1(19.94,85.17) v1(20.7,99.27) v1(20.7,97.74) v1(22.1,99.27) v1(22.1,97.74) v1(22.48,84.53) v1(23.5,99.27) v1(31.5,71.58) v1(31.5,69.29) v1(31.5,57.1) v1(31.5,53.29) v1(31.5,9.98) v1(34.42,16.08) v1(34.93,9.98) v1(35.82,19.13) v1(37.59,72.47) v1(38.48,9.98) v1(39.75,21.8) v1(40.77,56.59) v1(40.77,52.28) v1(40.77,48.1) v1(40.77,43.77) v1(40.77,39.7) v1(40.77,35.51) v1(40.77,31.32) v1(40.77,27.13) v1(40.78,68.22) v1(41.79,13.16) v1(42.42,24.46) v1(43.69,29.92) v1(44.58,71.45) v1(44.71,16.08) v1(45.21,27.38) v1(46.36,32.59) v1(47.63,19) v1(48.14,30.18) v1(48.77,71.45) v1(48.77,67.39) v1(48.77,62.69) v1(48.77,57.74) v1(48.77,52.78) v1(48.77,47.7) v1(48.77,43.51) v1(48.77,39.32) v1(48.77,35.13) v1(50.8,32.84) v1(50.8,29.42) v1(50.8,25.86) v1(50.8,22.18) v1(50.93,71.45) v1(51.18,52.28) v1(67.06,88.47) v1(69.78,92.93) v1(73.66,92.92) v1(73.66,88.47) v1(77.35,92.92) v1(80.9,92.92) v1(80.9,88.47) v1(84.71,92.92) v1(88.52,92.92) v1(88.52,88.47) v1(90.43,79.83) v1(92.33,92.92) v1(95.63,44.66) v1(95.63,40.97) v1(95.63,37.54) v1(95.63,33.86) v1(95.63,29.67) v1(95.63,25.61) v1(95.89,92.92) v1(95.89,88.47) v1(96.01,73.99) v1(97.79,67.9) v1(97.79,57.86) v1(97.79,49.1) v1(98.43,22.81) v1(98.55,41.35) v1(99.32,92.92) v1(101.35,38.94) v1(103,22.81) v1(104.02,36.53) v1(106.56,36.53) v1(107.19,22.81) v1(111.13,36.53) v1(111.51,22.81) v1(115.45,36.53) v1(115.45,32.08) v1(115.45,22.81) v1(115.57,84.66) v1(115.7,67.13)
VBUS: length 121.4
  Top Layer w0.254: v1(40.58,85.8) 40.58,82.82 38.1,80.34 v1(34.55,80.34) ; USB1.A9 USB1.B4 74.53,95.56 73.54,94.57 72.03,94.57 71.95,94.65 71.95,96.21 72.03,96.29 USB1.B9 USB1.A4 ; 66.99,95.84 66.99,105.67 68.58,107.27 73.15,107.27 73.41,107.52 73.41,108.42 ; v1(14.35,61.93) 13.21,60.78 13.13,60.78 ; 58.48,95.84 58.5,95.82 v1(58.5,94.9)
  Top Layer w0.381: D4.2 68.58,95.84 69.85,94.57 71.86,94.57 71.95,94.65
  Bottom Layer w0.254: v1(58.5,94.9) 56.01,97.39 47.34,97.39 42.36,92.41 42.36,87.58 v1(40.58,85.8) ; v1(14.35,61.93) 15.5,63.07 15.5,75.77 16.45,76.72 32.07,76.72 34.55,79.2 v1(34.55,80.34)
ADC1: length 52.5
  Top Layer w0.254: R26.1 v1(39.56,96.34) ; C28.2 R27.2 62.99,122.64 62.99,122.63 63.17,122.45 64.09,122.45 64.91,123.28 U1.5 67.81,123.28 v1(67.82,123.27)
  Bottom Layer w0.254: v1(67.82,123.27) 67.82,121.11 62.74,116.03 55.63,116.03 39.63,100.03 39.63,96.41 v1(39.56,96.34)
ADC2: length 60.4
  Top Layer w0.254: R28.1 41.28,94.81 v1(41.28,96.34) ; v1(68.58,122.38) 68.53,122.43 U1.6 64.82,122.43 64.16,121.77 62.59,121.77 61.6,122.76 57.91,122.76 55.1,125.57 C29.2 55.07,125.63 R29.2
  Bottom Layer w0.254: v1(41.28,96.34) 41.28,100.79 55.63,115.14 63.12,115.14 68.58,120.6 v1(68.58,122.38)
ANT: length 6.4
  Top Layer w0.508: 51.37,120.79 49.41,118.82 49.41,117.05 49.8,116.66 U2.21
BATT_ON: length 31
  Top Layer w0.254: v1(11.94,87.84) 8.89,84.79 8.75,84.79 8.75,82.99 7.81,82.05 5.34,82.05 ; R36.1 4.96,81.67 5.34,82.05 ; TP4.1 5.34,82.25 5.34,82.05 ; v1(15.55,97.93) 16.61,99 16.61,99.02 17.52,99.93 17.54,99.93 19.42,101.81 R35.1 R37.2
  Bottom Layer w0.254: v1(15.55,97.93) 15.5,97.88 15.5,91.39 v1(11.94,87.84)
CHIP_EN: length 11.7
  Top Layer w0.254: U1.45 83.58,126.68 83.61,126.71 ; R1.1 83.61,126.71 ; 83.61,126.71 83.61,125.86 84.54,124.92 87.86,124.92 89.16,123.62
ESP_POW_OFF: length 86.5
  Top Layer w0.254: v1(13.85,99.9) 20.2,106.25 24.77,106.25 25.4,106.89 25.4,109.62 30.1,114.32 40.2,114.32 42.67,111.84 v1(53.6,111.84) ; U1.29 78.13,114.74 v1(77.09,115.78) ; R33.2 11.31,95.19 v1(11.31,95.2)
  Bottom Layer w0.254: v1(11.31,95.2) 12.58,95.2 13.71,96.33 13.71,99.76 v1(13.85,99.9) ; v1(77.09,115.78) 76.33,116.54 65.53,116.54 62.99,114 55.76,114 v1(53.6,111.84)
ESP_POW_SW: length 111.9
  Top Layer w0.254: v1(52.58,111.08) 42.42,111.08 39.88,113.62 30.36,113.62 26.04,109.3 26.04,106.5 25.15,105.62 20.32,105.62 16.64,101.93 v1(16.64,100.92) ; v1(76.87,114.92) 77.28,114.51 U1.28 ; v1(4.57,69.04) R44.1
  Bottom Layer w0.254: v1(16.64,100.92) 16.13,100.41 16.13,88.15 13.72,85.74 13.72,83.9 10.35,80.53 8.51,80.53 7.5,79.52 7.5,73.74 4.57,70.82 v1(4.57,69.04) ; v1(52.58,111.08) 53.72,111.08 55.76,113.11 62.87,113.11 65.79,116.03 75.75,116.03 v1(76.87,114.92)
GPS_ON: length 15.8
  Top Layer w0.254: R11.2 131.32,57.09 131.32,63.32 126.37,68.28 U3.5
GPS_PPS: length 116.8
  Top Layer w0.254: v1(122.94,69.38) U3.4 126.28,69.38 133.1,62.56 v1(133.1,61.93) ; v1(133.1,59.01) 132.08,57.99 R12.2 132.97,57.09 132.97,55.58 132.08,54.69 R13.1 ; v1(119.26,111.46) 121.29,111.46 124.15,108.6 124.15,98.82 124.72,98.25 v1(125.73,98.25) ; v1(81.41,120.73) U1.38
  Bottom Layer w0.254: v1(125.73,98.25) 125.73,96.98 121.92,93.17 121.92,70.39 v1(122.94,69.38) ; v1(133.1,59.01) v1(133.1,61.93) ; v1(119.26,111.46) 118.62,110.82 105.92,110.82 99.95,116.79 99.95,119.08 97.54,121.49 88.14,121.49 86.62,119.97 82.17,119.97 v1(81.41,120.73)
GPS_RXD: length 84.8
  Top Layer w0.254: 91.7,116.66 92.51,117.48 92.51,117.92 92.97,118.38 92.97,120.09 93.54,120.67 98.36,120.67 100.21,118.82 100.21,116.92 106.3,110.82 121.03,110.82 123.45,108.41 123.45,79.45 129.29,73.61 129.29,71.96 127.81,70.48 124.88,70.48
GPS_TXD: length 80.9
  Top Layer w0.254: v1(101.48,113.74) 102.49,113.74 105.92,110.31 120.65,110.31 122.68,108.28 122.68,79.2 128.65,73.23 128.65,72.21 128.02,71.58 U3.2
  Bottom Layer w0.254: H3.1 89.89,116.66 91.17,117.94 92.53,117.94 92.85,118.26 93.52,118.26 94.28,117.5 97.72,117.5 v1(101.48,113.74)
HART1: length 14.3
  Top Layer w0.254: H1.3 63.77,103.85 63.77,106.87 69.63,112.73 U1.19
HART2: length 21.8
  Top Layer w0.254: U1.20 70.49,113.69 70.49,112.73 64.33,106.57 64.33,102.19 63.28,101.14 61.6,101.14 61.09,101.65 61.09,103.67 H1.2
I2C_SCL: length 137.6
  Top Layer w0.203: U5.23 93.21,104.45 92.76,104.91 92.43,104.91 90.44,106.9
  Top Layer w0.254: v1(73.54,114.94) 72.36,114.94 72.18,114.76 U1.22 ; v1(75.19,110.82) 75.82,110.19 77.47,110.19 79.76,107.9 87.25,107.9 v1(88.52,109.17) ; U7.1 96.27,116.03 96.27,116.54 96.52,116.79 96.52,117.3 96.27,117.55 95.41,117.55 94.62,116.76 94.62,114.51 v1(93.86,113.74) ; v1(118.24,97.49) 99.82,97.49 97.54,95.2 91.7,95.2 86.84,100.06 H5.4 84.56,101.27 85.28,102 R51.2 86.25,102.71 92.97,109.43 92.97,112.47 92.59,112.85 90.43,112.85 H4.4 ; v1(124.91,97.49) 124.97,97.42 124.97,80.09 130.56,74.5 130.56,72.21 131.19,71.58 U3.17
  Bottom Layer w0.254: v1(124.91,97.49) v1(118.24,97.49) ; v1(93.86,113.74) 92.97,112.85 90.43,112.85 H4.4 89.16,109.81 v1(88.52,109.17) ; v1(75.19,110.82) 75.19,113.29 v1(73.54,114.94)
I2C_SDA: length 146
  Top Layer w0.203: U5.24 92.81,104.25 92.59,104.47 91.57,104.47 v1(90.3,105.74)
  Top Layer w0.254: v1(71.38,115.01) 71.38,113.75 U1.21 ; 89.23,106.57 86.11,103.46 84.52,103.46 R50.2 83.76,101.37 83.56,101.17 H5.3 83.56,98.64 84.2,98 87.63,98 91.19,94.44 97.79,94.44 99.95,96.6 v1(118.62,96.6) ; 89.23,106.57 88.34,107.46 79.57,107.46 77.4,109.63 75.26,109.63 v1(75.25,109.62) ; 89.23,106.57 91.7,109.04 H4.3 90.43,110.31 88.52,110.31 87.89,110.95 87.89,112.41 88.9,113.43 92.9,113.43 93.47,112.85 96.14,112.85 96.78,113.49 96.78,114 U7.6 ; v1(124.27,96.6) 124.21,96.54 124.21,79.83 129.92,74.12 129.92,71.83 131.32,70.44 134.16,70.44 134.2,70.48
  Bottom Layer w0.254: v1(90.3,105.74) 90.3,107.65 91.7,109.04 H4.3 ; v1(71.38,115.01) 71.89,115.52 74.42,115.52 75.77,114.18 75.77,110.14 v1(75.25,109.62) ; v1(124.27,96.6) v1(118.62,96.6)
IMU_INT: length 50.3
  Top Layer w0.203: R24.1 96.36,99.67 94.81,101.22
  Top Layer w0.254: R24.1 97.49,97.58 98.59,97.58 99,98 99,100.47 97.16,102.31 97.16,107.14 99.82,109.81 99.82,116.41 98.94,117.3 v1(98.94,118.19) ; U1.37 v1(81.28,119.88)
  Bottom Layer w0.254: v1(81.28,119.88) 81.83,119.33 86.87,119.33 88.39,120.86 97.16,120.86 98.94,119.08 v1(98.94,118.19)
LOAD_ON: length 104.4
  Top Layer w0.254: v1(41.79,103.84) 41.79,103.71 v1(43.5,102) ; v1(76.84,112.09) 76.43,112.5 U1.27 ; v1(6.75,77.04) 6.75,77.99 6.67,77.92 5.2,77.92 R40.2
  Bottom Layer w0.254: v1(43.5,102) 47.5,106 61.89,106 61.91,106.02 62.81,106.02 62.83,106 65.03,106 69.73,110.7 73.92,110.7 74.3,110.31 74.3,109.55 75.06,108.79 75.31,108.79 76.84,110.31 v1(76.84,112.09) ; v1(6.75,77.04) 5.72,78.07 5.72,80.85 10.42,85.55 10.42,87.33 14.73,91.65 v1(14.73,98.88) 14.73,100.28 16.26,101.81 21.34,101.81 24.13,104.6 41.02,104.6 v1(41.79,103.84)
LORA_BUSY: length 21.7
  Top Layer w0.254: 51.07,103.47 52.21,103.47 59.88,111.14 66.36,111.14 67.95,112.73 67.95,113.68 U1.17
LORA_INT: length 27.3
  Top Layer w0.254: R20.2 52.99,101.54 52.34,102.2 ; U1.18 68.78,112.73 66.58,110.53 60.29,110.53 52.71,102.95 52.71,102.57 52.34,102.2 ; 52.34,102.2 U2.13
LORA_NSS: length 37
  Top Layer w0.254: R19.1 40.01,112.47 42.67,109.82 U2.19 52.72,109.82 60.23,117.33 U1.12
LORA_RST: length 40.7
  Top Layer w0.254: U1.16 67.08,112.62 66.3,111.84 59.44,111.84 52.34,104.74 U2.15 45.85,104.74 39.64,110.95 R18.1
MISO: length 18.6
  Top Layer w0.254: U1.15 61.24,114.78 52.46,106.01 U2.16
MOSI: length 18.4
  Top Layer w0.254: U2.17 52.59,107.28 60.94,115.63 U1.14
POWER_SW: length 13.9
  Top Layer w0.254: D15.2 9.91,71.66 9.91,73.02 10.04,73.15 9.7,73.15 9.27,72.72 8.83,72.72 C18.2 7.82,71.83 R43.2 R44.2 R42.1 TP7.1
PSR_CE: length 16.9
  Top Layer w0.254: U1.8 62.74,120.73 62.06,121.4 57.75,121.4 56.17,122.98 53.95,122.98 53.6,122.63 53.6,121.11 53.98,120.73 U4.2
PSR_MISO: length 11.7
  Top Layer w0.254: U4.1 56.39,122 58.3,120.09 62.74,120.09 62.96,119.88 U1.9
PSR_MOSI: length 5.5
  Top Layer w0.254: U1.11 60.61,118.18 U4.5
PSR_SCK: length 5.6
  Top Layer w0.254: U1.10 62.79,119.03 62.36,119.46 U4.6
PWM_AUDIO: length 28.5
  Top Layer w0.254: v1(97.92,106) 99.51,104.41 C12.1 ; v1(90.3,108.92) 89.26,109.96 88.05,109.96 87.24,110.77 81.88,110.77 81.7,110.94 80.89,110.94 78.98,112.85 U1.30
  Bottom Layer w0.254: v1(90.3,108.92) 89.72,108.33 89.72,105.5 90.06,105.16 90.54,105.16 91.38,106 v1(97.92,106)
RGB1: length 65.8
  Top Layer w0.254: P4.2 117.35,87.12 119.68,89.45 119.68,107.52 118.91,108.28 103.38,108.28 v1(102.11,109.55) ; R6.2 v1(86.62,108.54)
  Bottom Layer w0.254: v1(86.62,108.54) 86.62,110.95 90.05,114.38 97.28,114.38 v1(102.11,109.55)
RGB1Z: length 9
  Top Layer w0.254: U1.34 80.74,117.33 R6.1
RGB2: length 86.4
  Top Layer w0.254: R7.2 v1(85.22,108.54) ; v1(102.49,110.25) 103.95,108.79 119.38,108.79 120.4,107.77 120.4,71.71 118.29,69.6 P5.2
  Bottom Layer w0.254: v1(102.49,110.25) 102.17,110.25 97.54,114.89 89.92,114.89 85.22,110.19 v1(85.22,108.54)
RGB2Z: length 7.6
  Top Layer w0.254: R7.1 85.22,112.03 80.77,116.48 U1.33
RGB3: length 108.6
  Top Layer w0.254: v1(88.33,114.44) 92.65,114.44 93.73,115.52 v1(93.73,116.66) ; v1(103,110.95) 104.66,109.29 119.9,109.29 121.16,108.03 121.16,54.94 118.29,52.07 P6.2 ; R8.2 v1(83.82,108.54)
  Bottom Layer w0.254: v1(88.33,114.44) 83.82,109.93 v1(83.82,108.54) ; v1(103,110.95) 102.36,110.95 97.79,115.52 94.87,115.52 v1(93.73,116.66)
RGB3Z: length 6.2
  Top Layer w0.254: R8.1 83.82,112.58 80.77,115.63 U1.32
RGB4: length 129.1
  Top Layer w0.254: v1(93.09,117.68) 93.09,115.9 92.2,115.01 88.59,115.01 88.57,115.03 88.09,115.03 88.08,115.01 v1(87.76,115.01) ; R9.2 v1(82.43,108.54) ; v1(103.41,111.74) 105.39,109.77 120.31,109.77 121.92,108.16 121.92,39.32 117.15,34.55 P7.2
  Bottom Layer w0.254: v1(82.43,108.54) 82.43,109.68 v1(87.76,115.01) ; v1(103.41,111.74) 103.38,111.71 102.49,111.71 98.05,116.16 95.13,116.16 93.6,117.68 v1(93.09,117.68)
RGB4Z: length 4.8
  Top Layer w0.254: U1.31 80.88,114.78 82.43,113.24 R9.1
RXD0: length 12.2
  Top Layer w0.254: H2.1 89.16,120.35 85.85,123.65 84.72,123.65 R14.1 82.17,122.63 81.97,122.43 U1.40
RXEN: length 9.1
  Top Layer w0.254: R22.1 R23.1 Q9.3 31.4,107.28 U2.6
SCK: length 18.3
  Top Layer w0.254: U2.18 52.59,108.55 60.52,116.48 U1.13
SOLAR_IN: length 11.7
  Top Layer w1.27: D5.3 D5.1 37.09,49.64 P1.1
SOLAR_PWM: length 118
  Top Layer w0.254: U1.25 74.73,112.3 76.2,110.82 77.98,110.82 78.62,110.19 v1(78.67,110.19) ; R32.2 R31.1 38.99,23.19 50.17,34.37 v1(50.17,69.67)
  Bottom Layer w0.254: v1(50.17,69.67) 50.17,75.52 69.22,94.57 76.71,94.57 78.62,96.47 78.62,110.14 v1(78.67,110.19)
TXD0: length 13.7
  Top Layer w0.254: H2.2 90.43,117.93 90.28,117.93 90.27,117.94 88.04,117.94 88.03,117.93 87.63,117.93 85.73,119.84 84.85,119.84 R15.1 82.51,120.98 81.92,121.58 U1.39
TXEN: length 9.1
  Top Layer w0.254: U2.8 U2.7 37.06,106 35.18,106 TP10.1 31.5,105.36 31.24,105.62 R21.2
USB_N: length 5.5
  Top Layer w0.254: U1.23 73.03,111.46 72.46,110.89 72.46,108.42
USB_NZ: length 9.6
  Top Layer w0.254: USB1.B7 73.03,97.74 73.53,98.24 USB1.A7 73.53,102.83 72.52,103.84 72.52,106.06 D1.1
USB_P: length 5.5
  Top Layer w0.254: 74.36,108.42 74.36,110.95 73.88,111.42 73.88,113.7 U1.24
USB_PZ: length 13.9
  Top Layer w0.254: v1(73.54,95.96) 73.54,97.13 USB1.B6 ; USB1.A6 73.03,99.65 72.9,99.78 v1(72.9,100.54) ; D1.3 74.36,104.15 v1(73.92,103.71)
  Bottom Layer w0.254: v1(73.92,103.71) 72.9,102.69 v1(72.9,100.54) 73.54,99.9 v1(73.54,95.96)
V_SOLAR: length 125.1
  Top Layer w0.254: v1(41.28,91.9) 41.28,93.18 R28.2 ; R30.2 33.53,23.2 33.53,26.09 Q4.1
  Top Layer w0.381: D5.2 32.4,38.43 29.72,38.43 29.09,39.07 29.09,41.1 27.31,42.88 12.32,42.88 10.8,44.4 10.8,57.23 11.81,58.24 11.81,64.06 D12.2 14.23,66.48 14.23,74.37 11.56,77.04 11.56,81.74 12.07,82.25 15.12,82.25 v3(15.75,82.88) ; v3(31.44,83.33) 29.99,83.33 D9.2
  Top Layer w0.635: 35.44,28.91 35.88,29.36 35.88,34.95 D5.2 ; 35.44,28.91 35.88,28.46 35.88,26.82 35.44,26.37 Q4.1 ; 35.44,28.91 Q4.3
  Bottom Layer w0.254: v1(41.28,91.9) 38.29,91.9 31.44,85.04 v3(31.44,83.33)
  Bottom Layer w0.381: v3(15.75,82.88) 16.39,82.25 30.36,82.25 v3(31.44,83.33)
$1N4230: length 9.4
  Top Layer w0.254: v1(72.14,100.03) v1(72.14,101.81) 70.56,103.39 R4.2 ; USB1.B8 v1(72.53,95.96)
  Bottom Layer w0.254: v1(72.14,100.03) 72.53,99.63 v1(72.53,95.96)
$1N4235: length 4.9
  Top Layer w0.254: USB1.A8 74.04,98.87 74.04,100.16 R5.2
$1N5068: length 31.7
  Top Layer w0.254: 124.88,67.18 124.84,67.13 123.7,67.13 123.32,66.75 123.32,52.37 D2.1
  Top Layer w0.508: D2.1 126.52,51.23 127.42,50.34 C5.1 C6.1
$1N5476: length 2.2
  Top Layer w0.254: R13.2 130.5,54.75 Q1.1
$1N5630: length 2
  Top Layer w0.254: R10.1 124.58,55.7 Q1.3
$1N5669: length 2.7
  Top Layer w0.254: LED1.2 125.47,58.1 R10.2
$1N6709: length 4
  Top Layer w0.381: U3.14 135.58,68.28 L2.2
$1N6717: length 6.8
  Top Layer w0.254: R45.1 137.42,64.92 137.36,64.98
  Top Layer w0.508: C9.2 L2.1 137.36,64.98 134.2,64.98
$1N6857: length 1.9
  Top Layer w0.508: RF1.4 R45.2
$1N6929: length 2.8
  Top Layer w0.508: C9.1 ANT1.1
$1N7141: length 13.2
  Top Layer w0.254: U6.6 110.41,100.62 109.14,101.89 U6.2 105.65,101.89 C13.2 106.43,104.92 C14.1
$1N7143: length 3.6
  Top Layer w0.254: C14.2 109.32,107.08 BUZZER1.1
$1N7407: length 5.8
  Top Layer w0.254: U6.3 105.14,100.62 C27.2 104.52,101.31 R49.1
$1N7412: length 3.4
  Top Layer w0.254: C13.1 102.93,104.41 R49.2 102.85,104.44 R48.2
$1N7418: length 5
  Top Layer w0.254: R47.2 R46.1 101.22,102.91 R48.1 101.12,103.01 C12.2
$1N15871: length 39.7
  Top Layer w0.254: v1(16,79.71) 17.4,81.1 Q2.4 ; R38.1 v1(36.96,88.72) ; v1(9.27,79.71) 8.75,80.23 8.75,81.1
  Bottom Layer w0.254: v1(9.27,79.71) v1(16,79.71) 28.93,79.71 32.22,83 32.22,84.88 36.07,88.72 v1(36.96,88.72)
$1N23223: length 3.6
  Top Layer w0.254: SW3.2 94.71,127.99 R3.2
$1N23234: length 29.5
  Top Layer w0.254: v1(77.35,125.86) 70.79,125.86 69.06,124.13 U1.4 ; v1(82.74,124.48) 82.93,124.28 86.11,124.28 87.76,122.63 92.1,122.63 93.09,123.62
  Bottom Layer w0.254: v1(82.74,124.48) 81.36,125.86 v1(77.35,125.86)
$1N26209: length 5.9
  Top Layer w0.508: 51.52,122.29 50.29,123.52 RF2.5
$1N26688: length 3.7
  Top Layer w0.254: TP8.1 81.55,124.4 81.55,125.18 80.9,125.83 U1.44
$1N27231: length 5.5
  Top Layer w0.254: R21.1 28.79,106.33 30.1,106.33 30.24,106.19 Q9.1
$1N27414: length 4.8
  Top Layer w0.254: R23.2 27.18,106.24 27.18,105.27 28.96,103.49
$1N28291: length 2.6
  Top Layer w0.203: U5.9 93.61,99.01 R25.2
$1N28343: length 4.4
  Top Layer w0.203: 94.01,101.22 94.01,97.71 C30.2
$1N28865: length 41.4
  Top Layer w0.254: Q3.4 25.82,77.33 v1(26.04,77.55) ; R39.1 38.87,90.25 v1(37.72,90.25) ; v1(9.27,78.31) 8.75,77.79 8.75,77.04
  Bottom Layer w0.254: v1(37.72,90.25) 37.72,88.66 37.2,88.14 36.34,88.14 33.02,84.82 33.02,82.63 27.94,77.55 v1(26.04,77.55) 10.04,77.55 v1(9.27,78.31)
$1N29217: length 11.5
  Top Layer w0.254: 32.01,21.4 32.01,23.18 R30.1 30.75,24.46 30.74,24.46 30.74,29.54 31.37,30.18 Q4.4
$1N29863: length 8.7
  Top Layer w0.508: 51.39,95.84 48.8,93.25 D3.1
  Top Layer w0.635: C23.2 48.59,90.82 U9.3 48.64,90.85 D3.1
$1N30566: length 7.3
  Top Layer w0.508: C21.2 30.61,88.34 29.97,87.71
  Top Layer w0.762: D8.1 27.69,88.21 U8.1 29.05,88.64 29.97,87.71 D9.1
$1N33728: length 17.8
  Top Layer w1.27: D7.3 D7.1 22.99,56.48 22.99,54.05 L1.2 19.6,56.32 C20.2
$1N33737: length 32.6
  Top Layer w0.635: C19.2 14.65,32.08 17.23,34.66 L1.1 ; Q4.5 24.53,30.18 D10.2 21.28,26.37 Q4.8
  Top Layer w1.27: D10.2 21,33.26 L1.1
$1N34431: length 5.8
  Top Layer w0.254: 31.06,19.4 31.31,19.65 31.78,19.65 35.19,23.07 R31.2
$1N34822: length 14.5
  Top Layer w0.254: 9.73,60.91 9.73,63.08 D11.1 D12.1 D13.1 v1(7.86,67.66) 6.06,67.66 5.83,67.44 5.83,69.02 TP5.1
  Bottom Layer w0.254: v1(7.86,67.66) 5.98,67.66 SW5.2
$1N35006: length 13.7
  Top Layer w0.254: SW4.1 5.88,63.11 v1(7.61,63.11) ; SW4.1 5.83,64.23 2.92,67.13 R42.2 ; SW4.1 5.86,63.03 TP6.1
  Bottom Layer w0.254: SW5.1 v1(7.61,63.11)
$1N35994: length 1.7
  Top Layer w0.254: R35.2 20.99,101.76 D14.1
$1N36208: length 13.8
  Top Layer w0.254: R36.2 3.94,78.45 3.94,74.88 4.45,74.37 10.59,74.37 11.94,73.03
$1N36518: length 9.7
  Top Layer w0.254: R34.2 7.8,87.46 7.78,87.48 7.78,85.96 7.56,85.74 6.75,85.74 ; R33.1 8.13,91.27 6.79,89.94 6.79,88.47 C26.2
$1N37546: length 2.3
  Top Layer w0.254: R41.2 LED3.2
$1N37666: length 1.9
  Top Layer w0.254: LED4.2 84.99,114.61 R16.2
$1N37670: length 5.2
  Top Layer w0.254: LED4.1 82.19,118.5 81.66,119.03 U1.36
$1N37708: length 15.5
  Top Layer w0.254: R2.1 52.59,124.28 v1(54.99,124.28) ; U1.7 v1(64.9,121.58)
  Bottom Layer w0.254: v1(54.99,124.28) 62.19,124.28 v1(64.9,121.58)

## Copper pours and planes (outline as drawn; the poured copper is in the pictures)
3V3 on Top Layer: 60.93,89.21 60.93,87.2 53.69,79.96 42.93,79.96 42.8,80.09 42.8,89.36 42.95,89.21
3V3 on Inner2: 52.07,21.67 52.07,69.93 64.26,82.12 82.3,82.12 94.11,70.31 94.11,21.29 113.16,2.24 133.86,22.94 133.86,27.89 138.94,32.97 138.94,40.72 142.75,44.53 142.75,53.16 144.02,54.43 144.02,68.15 136.65,68.15 136.65,80.34 142.12,80.34 142.12,81.36 138.94,84.53 138.94,89.49 131.57,96.85 131.57,102.31 114.05,119.84 107.95,119.84 99.44,128.35 59.82,128.35 57.53,130.63 52.71,130.63 50.04,127.97 44.96,127.97 41.53,124.54 38.23,124.54 32.13,118.44 29.27,118.44 15.37,104.54 15.37,102.31 13.34,100.28 12.83,100.28 10.16,97.61 10.16,94.95 8,92.79 8,91.14 6.35,89.49 6.35,86.44 4.32,84.41 4.32,80.22 2.8,78.69 2.8,71.07 1.27,69.55 1.27,52.91 4.45,49.74 4.45,38.94 8.77,34.62 8.77,28.53 12.96,24.34 12.96,21.51 32.36,2.11 32.51,2.11
12V_BLAH on Top Layer: 25.53,82.37 25.53,77.93 22.61,77.93 22.48,77.8 22.48,76.66 22.61,76.53 26.39,76.53 26.42,76.5 26.42,75.39 29.34,75.39 29.34,68.15 21.19,68.15 21.19,76.16 20.96,76.53 17.66,76.53 17.66,80.81 20.27,80.81 21.21,81.61 21.21,82.37
12V_IN on Top Layer: 15.75,75.9 20.89,75.9 20.89,67.93 33.91,67.9 36.03,65.78 39.22,65.78 39.62,65.38 39.62,61.08 37.42,58.88 19.18,58.88 15.75,62.31
12V_LOAD on Top Layer: 36.69,79.5 53.83,79.5 66.17,91.77 99.56,91.77 102.49,94.57 116.7,94.57 116.7,89.2 111.38,89.2 111.38,77.1 116.66,77.1 116.72,77.04 116.72,71.85 111.4,71.85 111.38,71.83 111.38,59.57 116.66,59.57 116.72,59.51 116.72,37.32 104.57,37.28 94.11,47.36 94.11,70.18 82.31,82.12 64.27,82.12 55.78,73.49 36.69,73.49
12V_LOAD on Top Layer: 26.8,82.37 26.8,75.72 29.51,75.72 31.75,73.48 38.74,73.48 39.63,74.37 39.75,74.37 39.75,78.18 38.23,79.71 34.29,79.71 31.63,82.37
GND on Top Layer: 30.23,72.6 51.95,72.6 51.95,21.67 38.99,8.71 30.1,8.71 30.23,8.84
GND on Top Layer: 12.83,100.28 25.28,100.28 25.4,100.15 25.4,92.66 25.53,92.53 32.47,92.53 32.47,89.78 25.49,89.78 25.4,89.87 25.4,83.9 25.28,83.77 10.12,83.77 10.12,97.57
GND on Bottom Layer: 116.7,94.45 116.7,21.54 98.05,21.54 94.24,25.13 94.24,70.18 82.34,82.12 64.52,82.12 64.39,82.25 52.07,69.93 52.07,21.67 38.99,8.59 30.1,8.59 30.1,71.2 33.61,74.7 33.61,84.8 41.4,84.8 41.4,84.79 50.93,94.31 116.56,94.31
